# EAGLE design board (EAGLE 6.5.0)
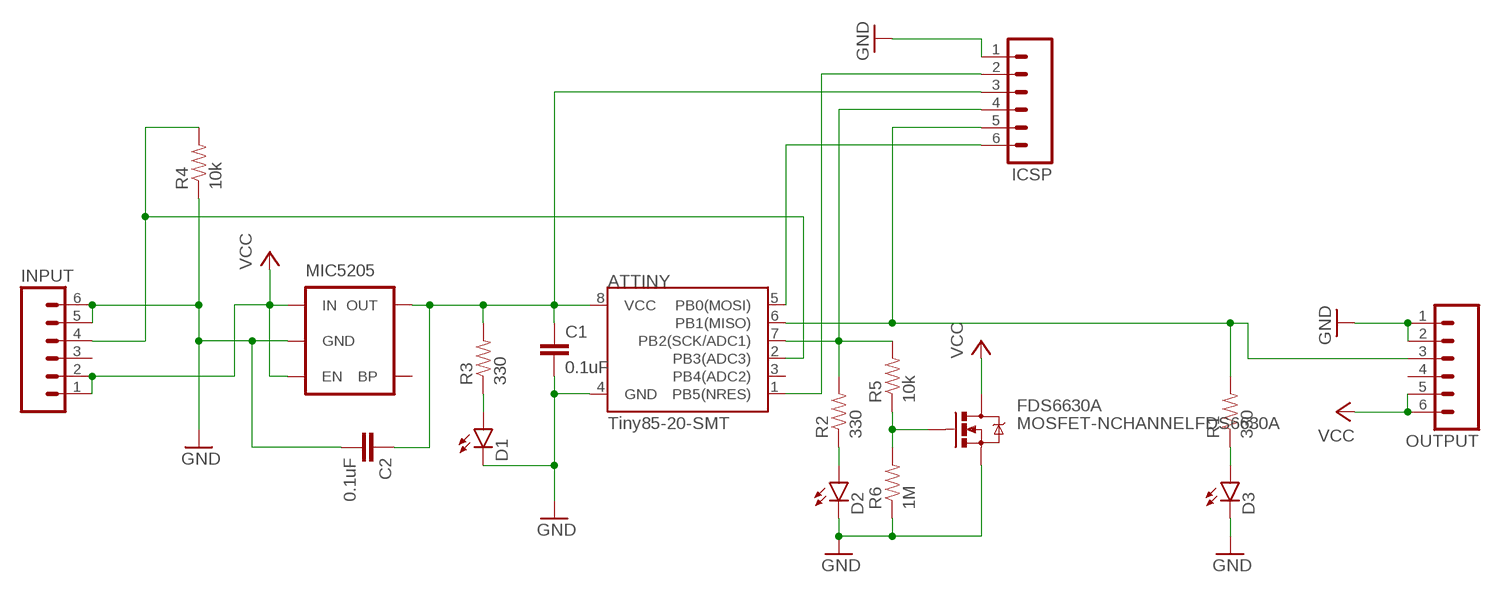
[diagram p0: schematic, sheet 1]

## Parts
ATTINY  Tiny85-20-SMT  ATTINY45TINY85-20-SMT  [SO08-EIAJ]
C1  0.1uF  1.0UF-25V-+80/-20(0805)  [0805]
C2  0.1uF  1.0UF-25V-+80/-20(0805)  [0805]
D1  LED0603  [LED-0603]
D2  LED0603  [LED-0603]
D3  LED0603  [LED-0603]
FDS6630A  MOSFET-NCHANNELFDS6630A  [SO08]
ICSP  M06SMD-FEMALE-V2  [1X06-SMD-FEMALE-V2]
INPUT  M06SMD-FEMALE-V2  [1X06-SMD-FEMALE-V2]
MIC5205  MIC52055V  [SOT23-5]
OUTPUT  M06SMD-FEMALE-V2  [1X06-SMD-FEMALE-V2]
R1  330  RESISTOR0603  [0603-RES]
R2  330  RESISTOR0603  [0603-RES]
R3  330  RESISTOR0603  [0603-RES]
R4  10k  RESISTOR0603  [0603-RES]
R5  10k  RESISTOR0805-RES  [0805]
R6  1M  RESISTOR0805-RES  [0805]

## Nets
GND: ATTINY.4(GND) C1.2 C2.2 D1.C D2.C D3.C FDS6630A.1(S) FDS6630A.2(S) FDS6630A.3(S) ICSP.1 INPUT.5 INPUT.6 MIC5205.2(GND) OUTPUT.1 OUTPUT.2 R4.1 R6.1
N$1: D1.A R3.1
N$2: D2.A R2.1
N$3: D3.A R1.1
N$4: ATTINY.8(VCC) C1.1 C2.1 ICSP.3 MIC5205.5(OUT) R3.2
N$5: ATTINY.2(PB3(ADC3)) INPUT.4 R4.2
N$6: ATTINY.6(PB1(MISO)) ICSP.5 OUTPUT.3 R1.2
N$7: ATTINY.5(PB0(MOSI)) ICSP.6
N$8: FDS6630A.4(G) R5.1 R6.2
N$9: ATTINY.7(PB2(SCK/ADC1)) ICSP.4 R2.2 R5.2
N$10: ATTINY.1(PB5(NRES)) ICSP.2
VCC: FDS6630A.5(D) FDS6630A.6(D) FDS6630A.7(D) FDS6630A.8(D) INPUT.1 INPUT.2 MIC5205.1(IN) MIC5205.3(EN) OUTPUT.5 OUTPUT.6
Unconnected: ATTINY.3(PB4(ADC2)) INPUT.3 MIC5205.4(BP) OUTPUT.4

## Library data of the parts
ATTINY = SparkFun-DigitalIC:ATTINY45: Atmel 8-pin 2/4/8kB flash uC; PROD_ID: IC-09092
C1 C2 = SparkFun-Capacitors:1.0UF-25V-+80/-20(0805): CAP-11625; PROD_ID: CAP-11625; VALUE: 1.0uF
D1-D3 = SparkFun-LED:LED: LEDs Standard schematic elements and footprints for 5mm, 3mm, 1206, and 0603 sized LEDs. 5mm - Spark Fun Electronics SKU : COM-00529 (and others)
FDS6630A = SparkFun-DiscreteSemi:MOSFET-NCHANNEL: Common NMOSFET Parts MFG P/N Store ID Prod ID FDD8780 TRANS-09984 SI7820DN TRANS-11055 FDS6630A IC-08089 2N7002PW TRANS-11151 FQP30N06L COM-10213 TRANS-10060 BSS123LT1G TRANS-08345 BSS138 TRANS-00830 BS170 2N7000; PROD_ID: IC-08089
ICSP INPUT OUTPUT = SparkFun-Connectors:M06: Header 6 Standard 6-pin 0.1" header. Use with straight break away headers (SKU : PRT-00116), right angle break away headers (PRT-00553), swiss pins (PRT-00743), machine pins (PRT-00117), and female headers (PRT-00115). Molex polarized connector foot print use with SKU : PRT-08094 with associated crimp pins and housings. NOTES ON THE VARIANTS LOCK and LOCK_LONGPADS... This footprint was designed to help hold the alignment of a through-hole component (i.e. 6-pin header) while soldering it into place. You may notice that each hole has been shifted either up or down by 0.005 of an inch from it's more standard position (which is a perfectly straight line). This slight alteration caused the pins (the squares in the middle) to touch the edges of the holes. Because they are alternating, it causes a "brace" to hold the component in place. 0.005 has proven to be the perfect amount of "off-center" position when using our standard breakaway headers. Although looks a little odd when you look at the bare footprint, once you have a header in there, the alteration is very hard to notice. Also,if you push a header all the way into place, it is covered up entirely on the bottom side. This idea of altering the position of holes to aid alignment will be further integrated into the Sparkfun Library for other footprints. It can help hold any component with 3 or more connection pins.
MIC5205 = SparkFun-PowerIC:MIC5205: MIC5205 150mA vreg 3.3V - VREG-00822 5V - VREG-00823; PROD_ID: VREG-00823
R1-R6 = SparkFun-Resistors:RESISTOR: Resistor Basic schematic elements and footprints for 0603, 1206, and PTH resistors.

## Board
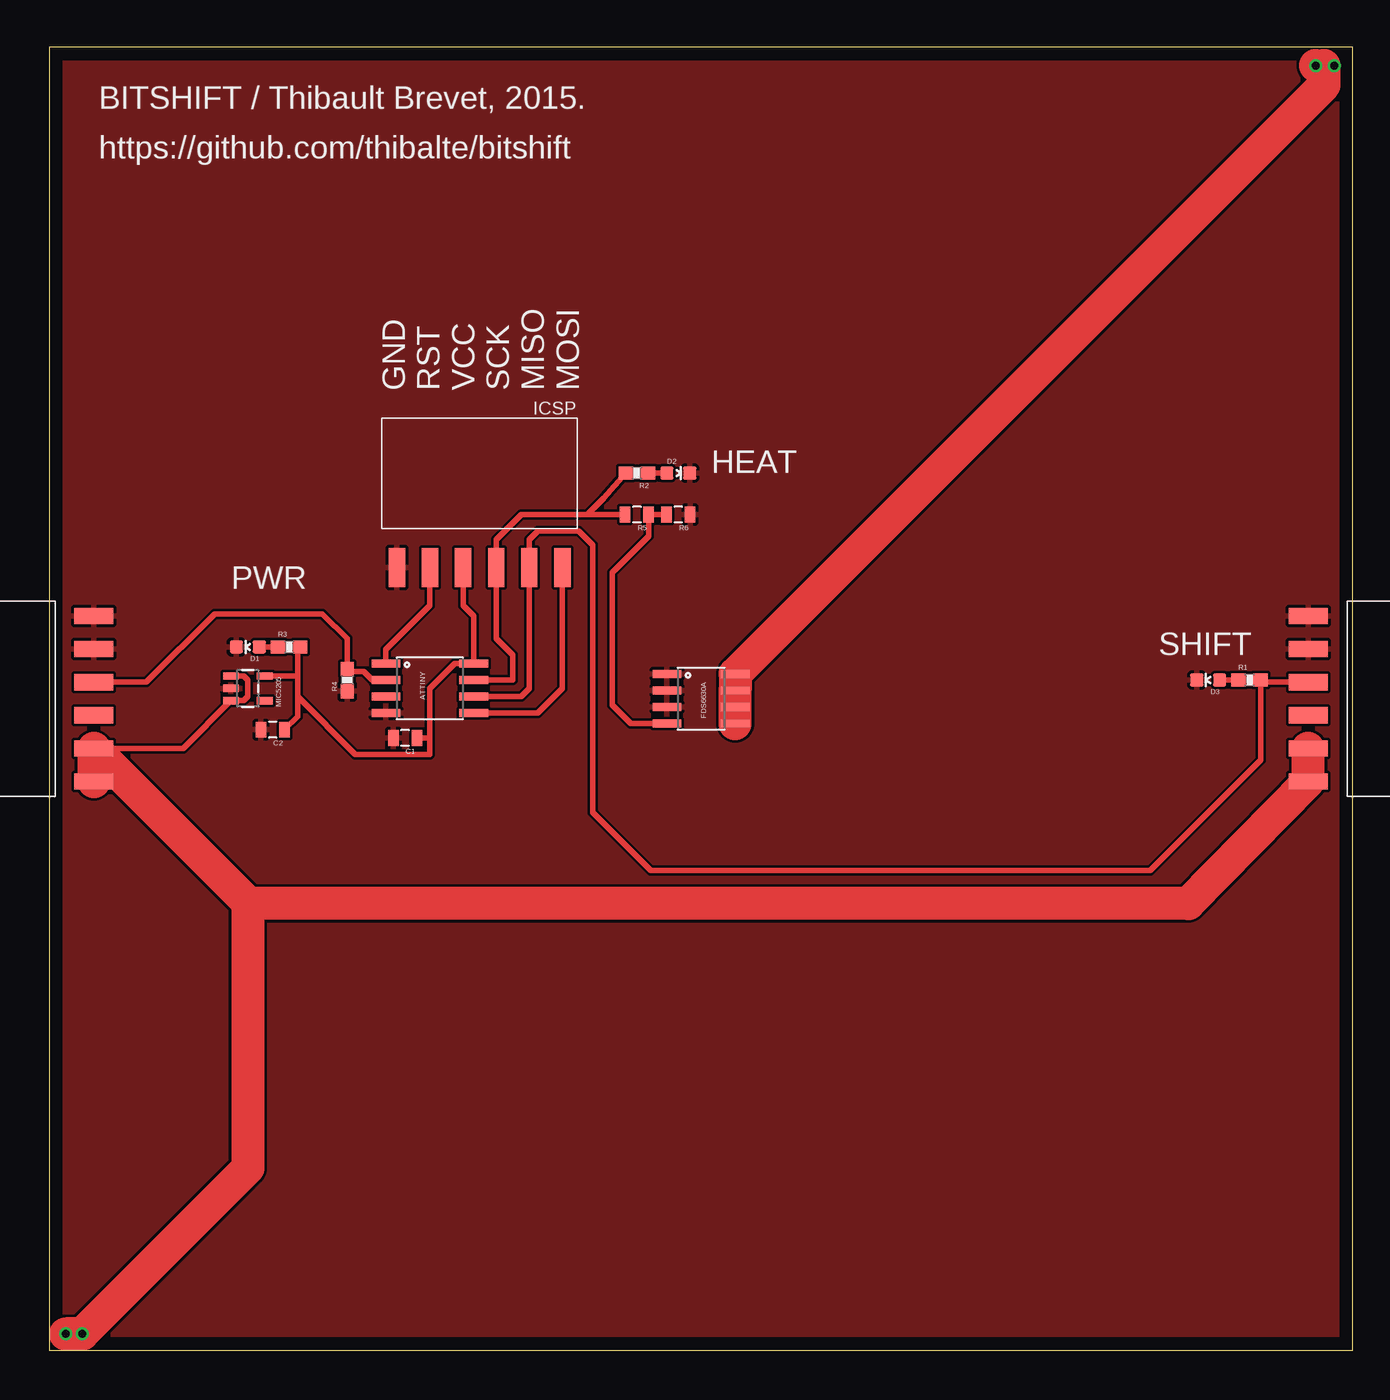
[diagram p1: board, top side]
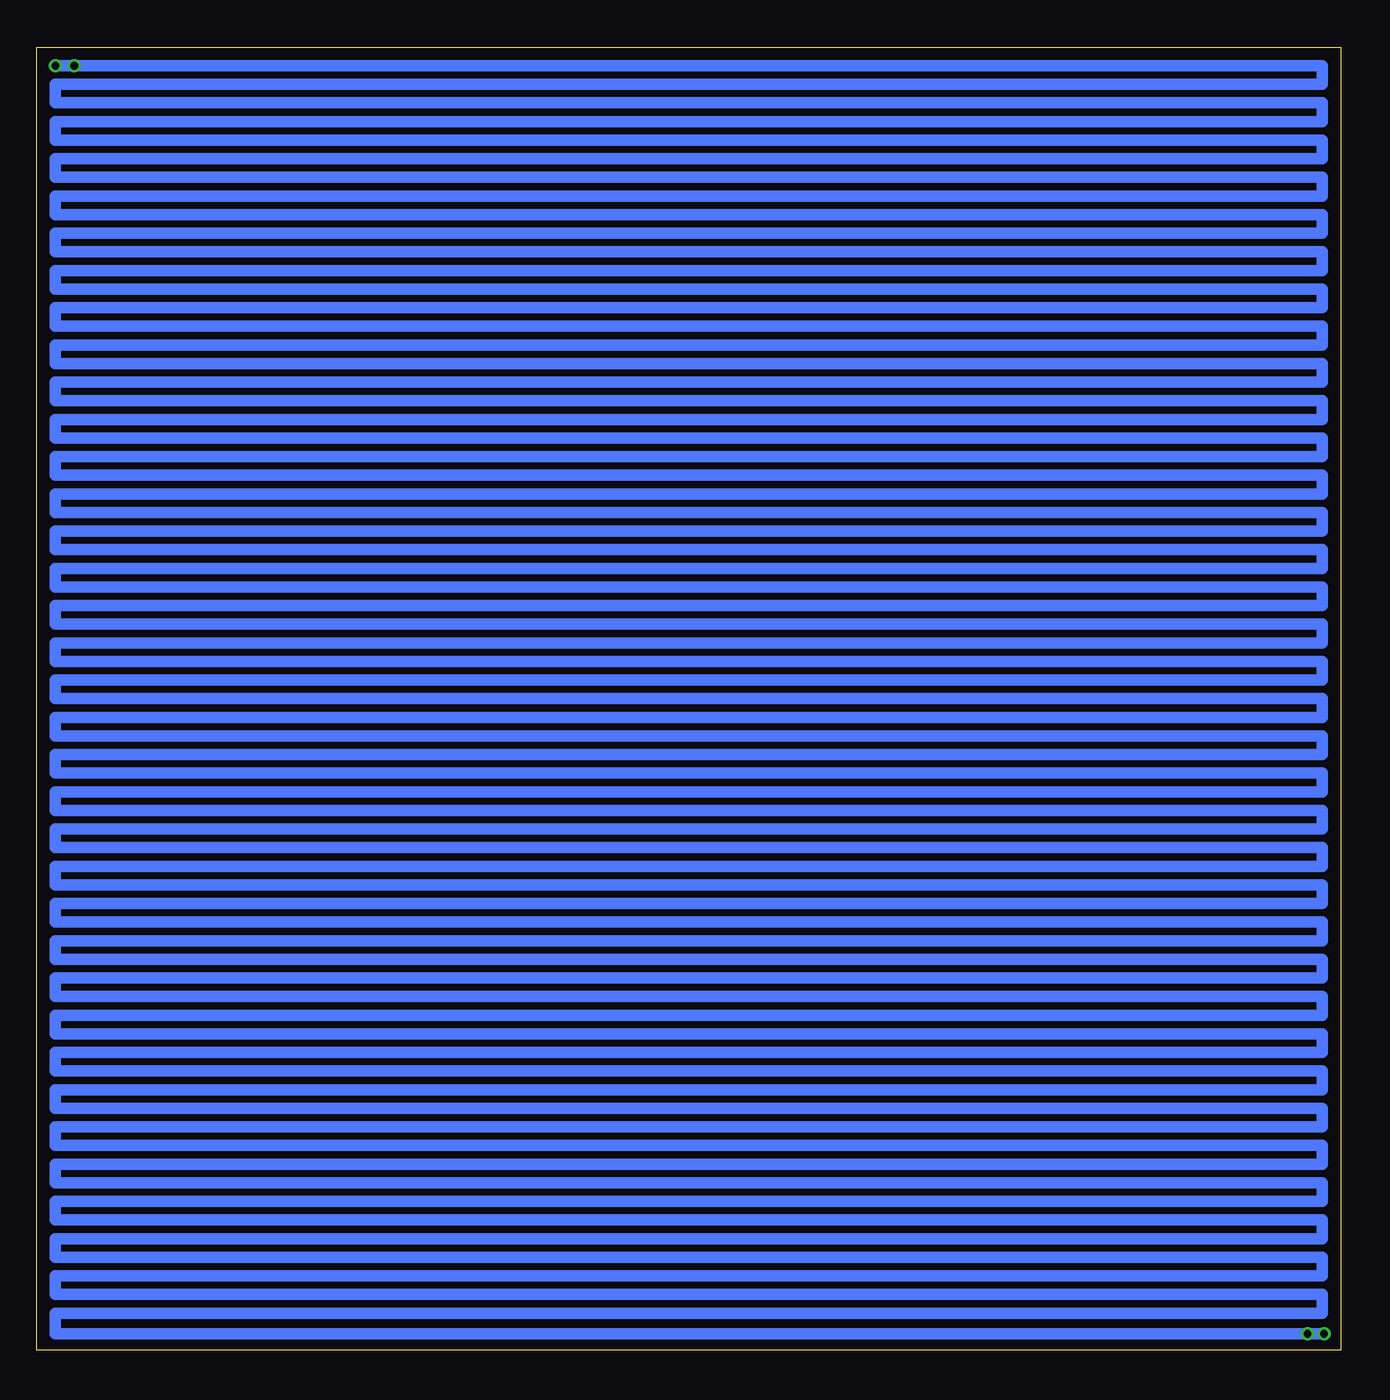
[diagram p2: board, bottom side, seen from below]

Size 100 x 100 mm. Coordinates in mm from the lower left corner, seen from the top.
Outline: 0,0 100,0 100,100 0,100 0,0
Copper layers (1*16): Top 0.035mm / dielectric 1.5mm / Bottom 0.035mm
Design rules "default": minimum track width 10mil, minimum drill 24mil, track to track 8mil, track to pad 8mil, pad to pad 8mil, via to via 8mil, smd to smd 8mil, copper to edge 40mil, drill to drill 8mil, minimum pad ring 10mil, minimum via ring 8mil, stop-mask expansion 4mil, vias tented up to drill 0mil, thermal gap 10mil

### Footprints (pad centres in the part's own frame; a part is rotated, then mirrored left to right if it is on the bottom)
SO08-EIAJ = smd 0.61 x 2.21: 1 -1.905,-3.378; 2 -0.635,-3.378; 3 0.635,-3.378; 4 1.905,-3.378; 5 1.905,3.353; 6 0.635,3.353; 7 -0.635,3.353; 8 -1.905,3.353
0805 = smd 0.8 x 1.2: 1 -0.9,0; 2 0.9,0
LED-0603 = smd 1 x 1: A 0,-0.877; C 0,0.877
SO08 = smd 0.61 x 2.21: 1 -1.905,-2.616; 2 -0.635,-2.616; 3 0.635,-2.616; 4 1.905,-2.616; 5 1.905,2.616; 6 0.635,2.616; 7 -0.635,2.616; 8 -1.905,2.616
1X06-SMD-FEMALE-V2 = smd 1.25 x 3: 1 6.35,3.425; 2 3.81,3.425; 3 1.27,3.425; 4 -1.27,3.425; 5 -3.81,3.425; 6 -6.35,3.425
SOT23-5 = smd 0.55 x 1.2: 1 -0.95,-1.3; 2 0,-1.3; 3 0.95,-1.3; 4 0.95,1.3; 5 -0.95,1.3
0603-RES = smd 1.1 x 1: 1 -0.85,0; 2 0.85,0

### Placement (x,y rotation side)
ATTINY  29.21,50.8 270 top
C1  27.3,46.99 180 top
C2  17.14,47.62 180 top
D1  15.24,53.98 90 top
D2  48.26,67.31 270 top
D3  88.9,51.44 90 top
FDS6630A  50,50 270 top
ICSP  33.02,63.5 180 top
INPUT  0,50 270 top
MIC5205  15.24,50.8 270 top
OUTPUT  100,50 90 top
R1  92.08,51.44 0 top
R2  45.09,67.31 180 top
R3  18.41,53.98 0 top
R4  22.86,51.44 90 top
R5  45.09,64.14 180 top
R6  48.26,64.14 180 top

### Tracks (layer width: path | path; a pad name or v marks a point on that pad's centre or on a via)
GND
  pour Top: -1.27,102.87 -1.27,-1.27 102.87,-1.27 102.87,102.87
N$1
  Top 0.406: D1.A R3.1
N$2
  Top 0.406: R2.1 D2.A
N$3
  Top 0.406: R1.1 D3.A
N$4
  Top 0.406: 29.21,46.99 29.21,50.8 31.11,52.7 ATTINY.8 32.56,56.34 31.75,57.15 ICSP.3 | 29.21,46.99 29.21,45.72 23.5,45.72 19.05,50.16 | 19.05,51.75 MIC5205.5 | C1.1 29.21,46.99 | R3.2 19.05,53.76 19.05,51.75 | 19.05,51.75 19.05,50.16 | C2.1 19.05,48.63 19.05,50.16
N$5
  Top 0.406: ATTINY.2 24.77,51.44 24.13,52.07 23.07,52.07 R4.2 22.86,54.61 20.95,56.52 12.7,56.52 7.46,51.27 INPUT.4
N$6
  Top 0.406: ATTINY.6 36.2,50.16 36.83,50.8 ICSP.5 36.83,62.23 37.47,62.87 40.64,62.87 41.7,61.81 41.7,41.27 46.14,36.83 84.45,36.83 92.92,45.3 R1.2 93.09,51.27 OUTPUT.3
N$7
  Top 0.406: ICSP.6 39.37,50.8 37.47,48.9 ATTINY.5
N$8
  Top 0.406: R6.2 R5.1 45.98,62.49 43.18,59.69 43.18,49.53 44.62,48.09 FDS6630A.4
N$9
  Top 0.406: ATTINY.7 35.56,51.44 35.56,53.34 34.29,54.61 ICSP.4 34.29,62.23 36.2,64.14 41.27,64.14 | R2.2 42.55,65.41 41.27,64.14 | R5.2 41.27,64.14
N$10
  Top 0.406: ATTINY.1 25.83,53.77 29.21,57.15 ICSP.2
VCC  (via drill 0.6 pad 0.61)
  Top 0.406: MIC5205.1 14.93,51.75 15.24,51.44 15.24,50.16 14.93,49.85 MIC5205.3 10.28,46.19 INPUT.2
  Top 2.54: OUTPUT.5 OUTPUT.6 87.38,34.29 15.24,34.29 | 15.24,34.29 15.16,34.29 | 15.24,34.29 15.24,13.97 v2.54,1.27 v1.27,1.27 | FDS6630A.5 FDS6630A.6 FDS6630A.7 FDS6630A.8 97.79,97.08 97.79,98.57 v97.14,98.57 | INPUT.1 INPUT.2 15.24,34.38 15.24,34.29
  Bottom 0.898: v1.27,1.27 98.57,1.27 98.57,2.86 1.43,2.86 1.43,4.29 98.57,4.29 98.57,5.71 1.43,5.71 1.43,7.14 98.57,7.14 98.57,8.57 1.43,8.57 1.43,10 98.57,10 98.57,11.43 1.43,11.43 1.43,12.86 98.57,12.86 98.57,14.29 1.43,14.29 1.43,15.71 98.57,15.71 98.57,17.14 1.43,17.14 1.43,18.57 98.57,18.57 98.57,20 1.43,20 1.43,21.43 98.57,21.43 98.57,22.86 1.43,22.86 1.43,24.29 98.57,24.29 98.57,25.71 1.43,25.71 1.43,27.14 98.57,27.14 98.57,28.57 1.43,28.57 1.43,30 98.57,30 98.57,31.43 1.43,31.43 1.43,32.86 98.57,32.86 98.57,34.29 1.43,34.29 1.43,35.72 98.57,35.72 98.57,37.14 1.43,37.14 1.43,38.57 98.57,38.57 98.57,40 1.43,40 1.43,41.43 98.57,41.43 98.57,42.86 1.43,42.86 1.43,44.29 98.57,44.29 98.57,45.72 1.43,45.72 1.43,47.14 98.57,47.14 98.57,48.57 1.43,48.57 1.43,50 98.57,50 98.57,51.43 1.43,51.43 1.43,52.86 98.57,52.86 98.57,54.29 1.43,54.29 1.43,55.72 98.57,55.72 98.57,57.14 1.43,57.14 1.43,58.57 98.57,58.57 98.57,60 1.43,60 1.43,61.43 98.57,61.43 98.57,62.86 1.43,62.86 1.43,64.29 98.57,64.29 98.57,65.72 1.43,65.72 1.43,67.14 98.57,67.14 98.57,68.57 1.43,68.57 1.43,70 98.57,70 98.57,71.43 1.43,71.43 1.43,72.86 98.57,72.86 98.57,74.29 1.43,74.29 1.43,75.72 98.57,75.72 98.57,77.14 1.43,77.14 1.43,78.57 98.57,78.57 98.57,80 1.43,80 1.43,81.43 98.57,81.43 98.57,82.86 1.43,82.86 1.43,84.29 98.57,84.29 98.57,85.72 1.43,85.72 1.43,87.14 98.57,87.14 98.57,88.57 1.43,88.57 1.43,90 98.57,90 98.57,91.43 1.43,91.43 1.43,92.86 98.57,92.86 98.57,94.29 1.43,94.29 1.43,95.72 98.57,95.72 98.57,97.14 1.43,97.14 1.43,98.57 v97.14,98.57 v98.57,98.57

### Text on the board
tNames: BITSHIFT / Thibault Brevet, 2015. | https://github.com/thibalte/bitshift | GND / RST / VCC / SCK / MISO / MOSI | HEAT | PWR | SHIFT